# Altium project soldering_station_handle.PrjPCB
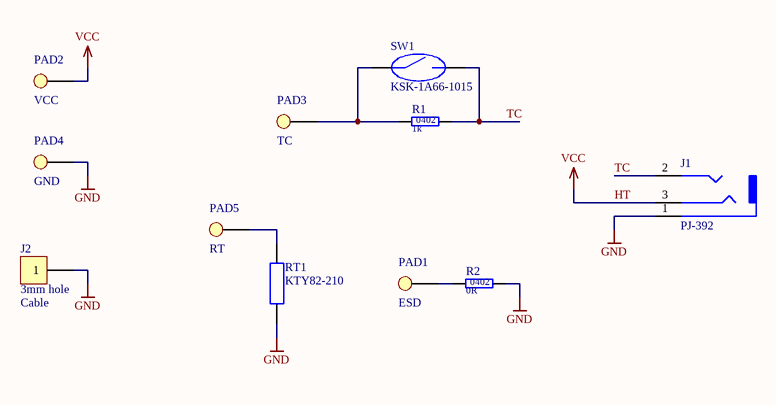
[diagram p0: soldering_station_handle.SchDoc]
1 sheet, 11 parts. Net scope: global (net labels, ports and power ports of the same name join across sheets).
Board file: soldering_station_handle.PcbDoc

## Sheet soldering_station_handle.SchDoc
size A4

### Parts
J1  PJ-392  [PJ-392_Edge]
J2  value 3mm hole  SCH_Footprint: Cable  [J_HOLE3]  (hidden comment: Cable soldering)
PAD1  ESD  [PAD_08mm]
PAD2  VCC  [PAD_08mm]
PAD3  TC  [PAD_08mm]
PAD4  GND  [PAD_08mm]
PAD5  RT  [PAD_08mm]
R1  value 1k  SCH_Footprint: 0402  [R_0402_1005]  (hidden comment: Resistor)
R2  value 0R  SCH_Footprint: 0402  [R_0402_1005]  (hidden comment: Resistor)
RT1  KTY82-210  [KTY82-210]
SW1  KSK-1A66-1015  [KSK-1A66-1015]

### Nets
GND: J1.1(SHIELD) J2.1 PAD4.1 R2.2 RT1.2
HT: J1.3(TIP) PAD2.1  [also labelled VCC]
TC: J1.2(RING) R1.2 SW1.2
NetPAD1_1: PAD1.1 R2.1
NetPAD3_1: PAD3.1 R1.1 SW1.1
NetPAD5_1: PAD5.1 RT1.1

### Library data of the parts
J1 = PJ-392_Jack_Plug: PCB Edge Mount
J2 = J_HOLE3: Single pin connector; Part Number: J_HOLE3; Component Type: Standard (No BOM); Supplier 1: TME; Supplier 2: RS Components; Supplier 3: Farnell; Supplier 4: Mouser; Supplier 5: Digi-Key
PAD1-PAD5 = J_PAD: PCB Pad; Part Number: J_PAD; SCH_Footprint: 1.4x2.5mm; Component Type: Standard; Supplier 1: TME; Supplier 2: RS Components; Supplier 3: Farnell; Supplier 4: Mouser; Supplier 5: Digi-Key
R1 = R_1k_0402_1: Manufacturer: Yageo; Manufacturer Part Number: RC0402FR-071K; Voltage: 50V; Power: 63mW; Tolerance: 1%; Part Number: R_1k_0402_1; HelpURL: http://www.tme.eu/pl/Document/1a2bc76e2be68b3b1670068306778ce6/rc0402yageo.pdf; Supplier 1: TME; Supplier Part Number 1: RC0402FR-071K; Supplier 2: RS Components; Supplier 3: Farnell; Supplier Part Number 3: 9239235; Supplier 4: Mouser; Supplier Part Number 4: 603-RC0402FR-071KP; Supplier 5: Digi-Key; Supplier Part Number 5: 311-1.00KLRCT-ND
R2 = R_0R_0402_5: Manufacturer: Rohm; Manufacturer Part Number: PMR01ZZPJ000; Voltage: 50V; Power: 100mW; Tolerance: 5%; Part Number: R_0R_0402_5; HelpURL: https://pl.mouser.com/datasheet/2/348/pmr-jpw-e-1139188.pdf; Supplier 1: TME; Supplier 2: RS Components; Supplier 3: Farnell; Supplier 4: Mouser; Supplier Part Number 4: 755-PMR01ZZPJ000; Supplier 5: Digi-Key; Supplier Part Number 5: RHM1692-6-ND
RT1 = KTY82-210: Czujnik temperatury; -55÷150°C; SOT23; SMD; 1,98kΩ; Value: 1.98k
SW1 = KSK-1A66-1015: Kontaktron; Zakres: 10÷15AT; Pprzeł: 10W; Ø2,2x14mm; Styki: SPST-NO